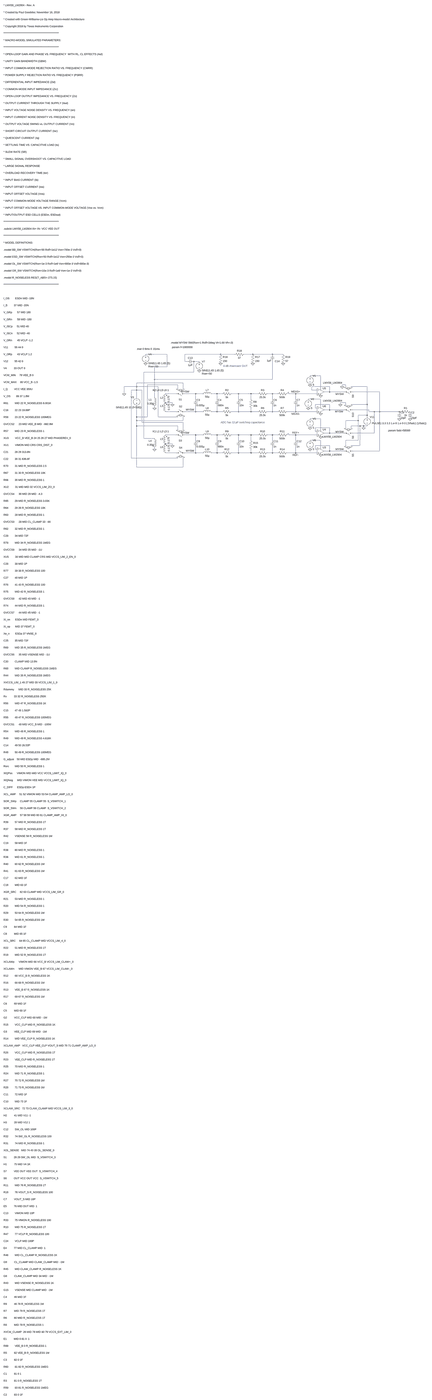
[diagram p0: schematic DiffVNAFull.asc, whole sheet]
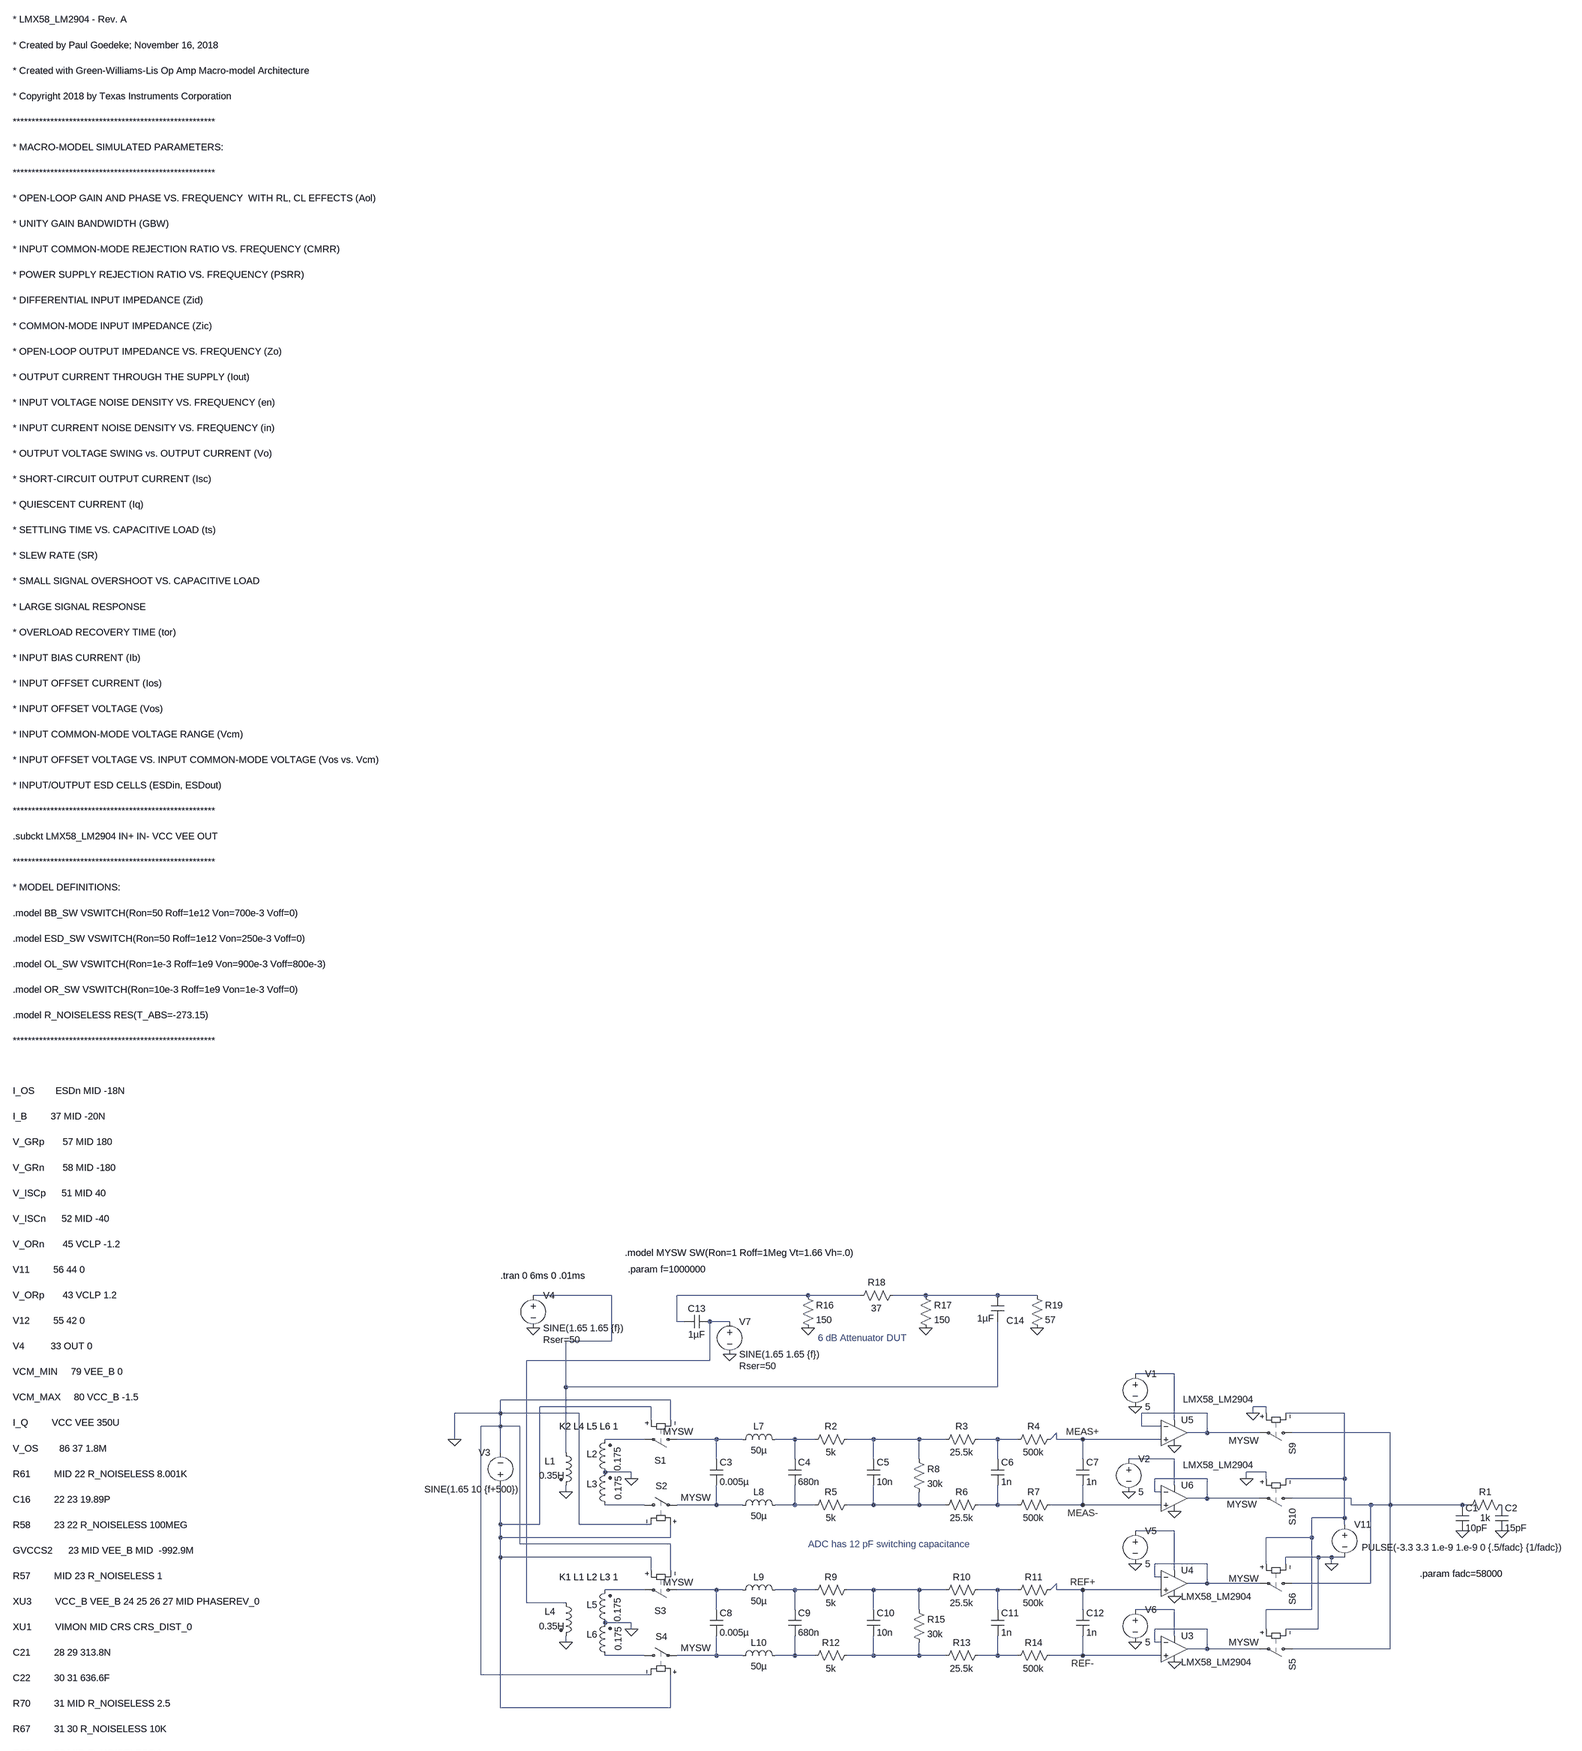
[diagram p1: schematic DiffVNAFull.asc, part, row 1 of 3, column 1 of 1]
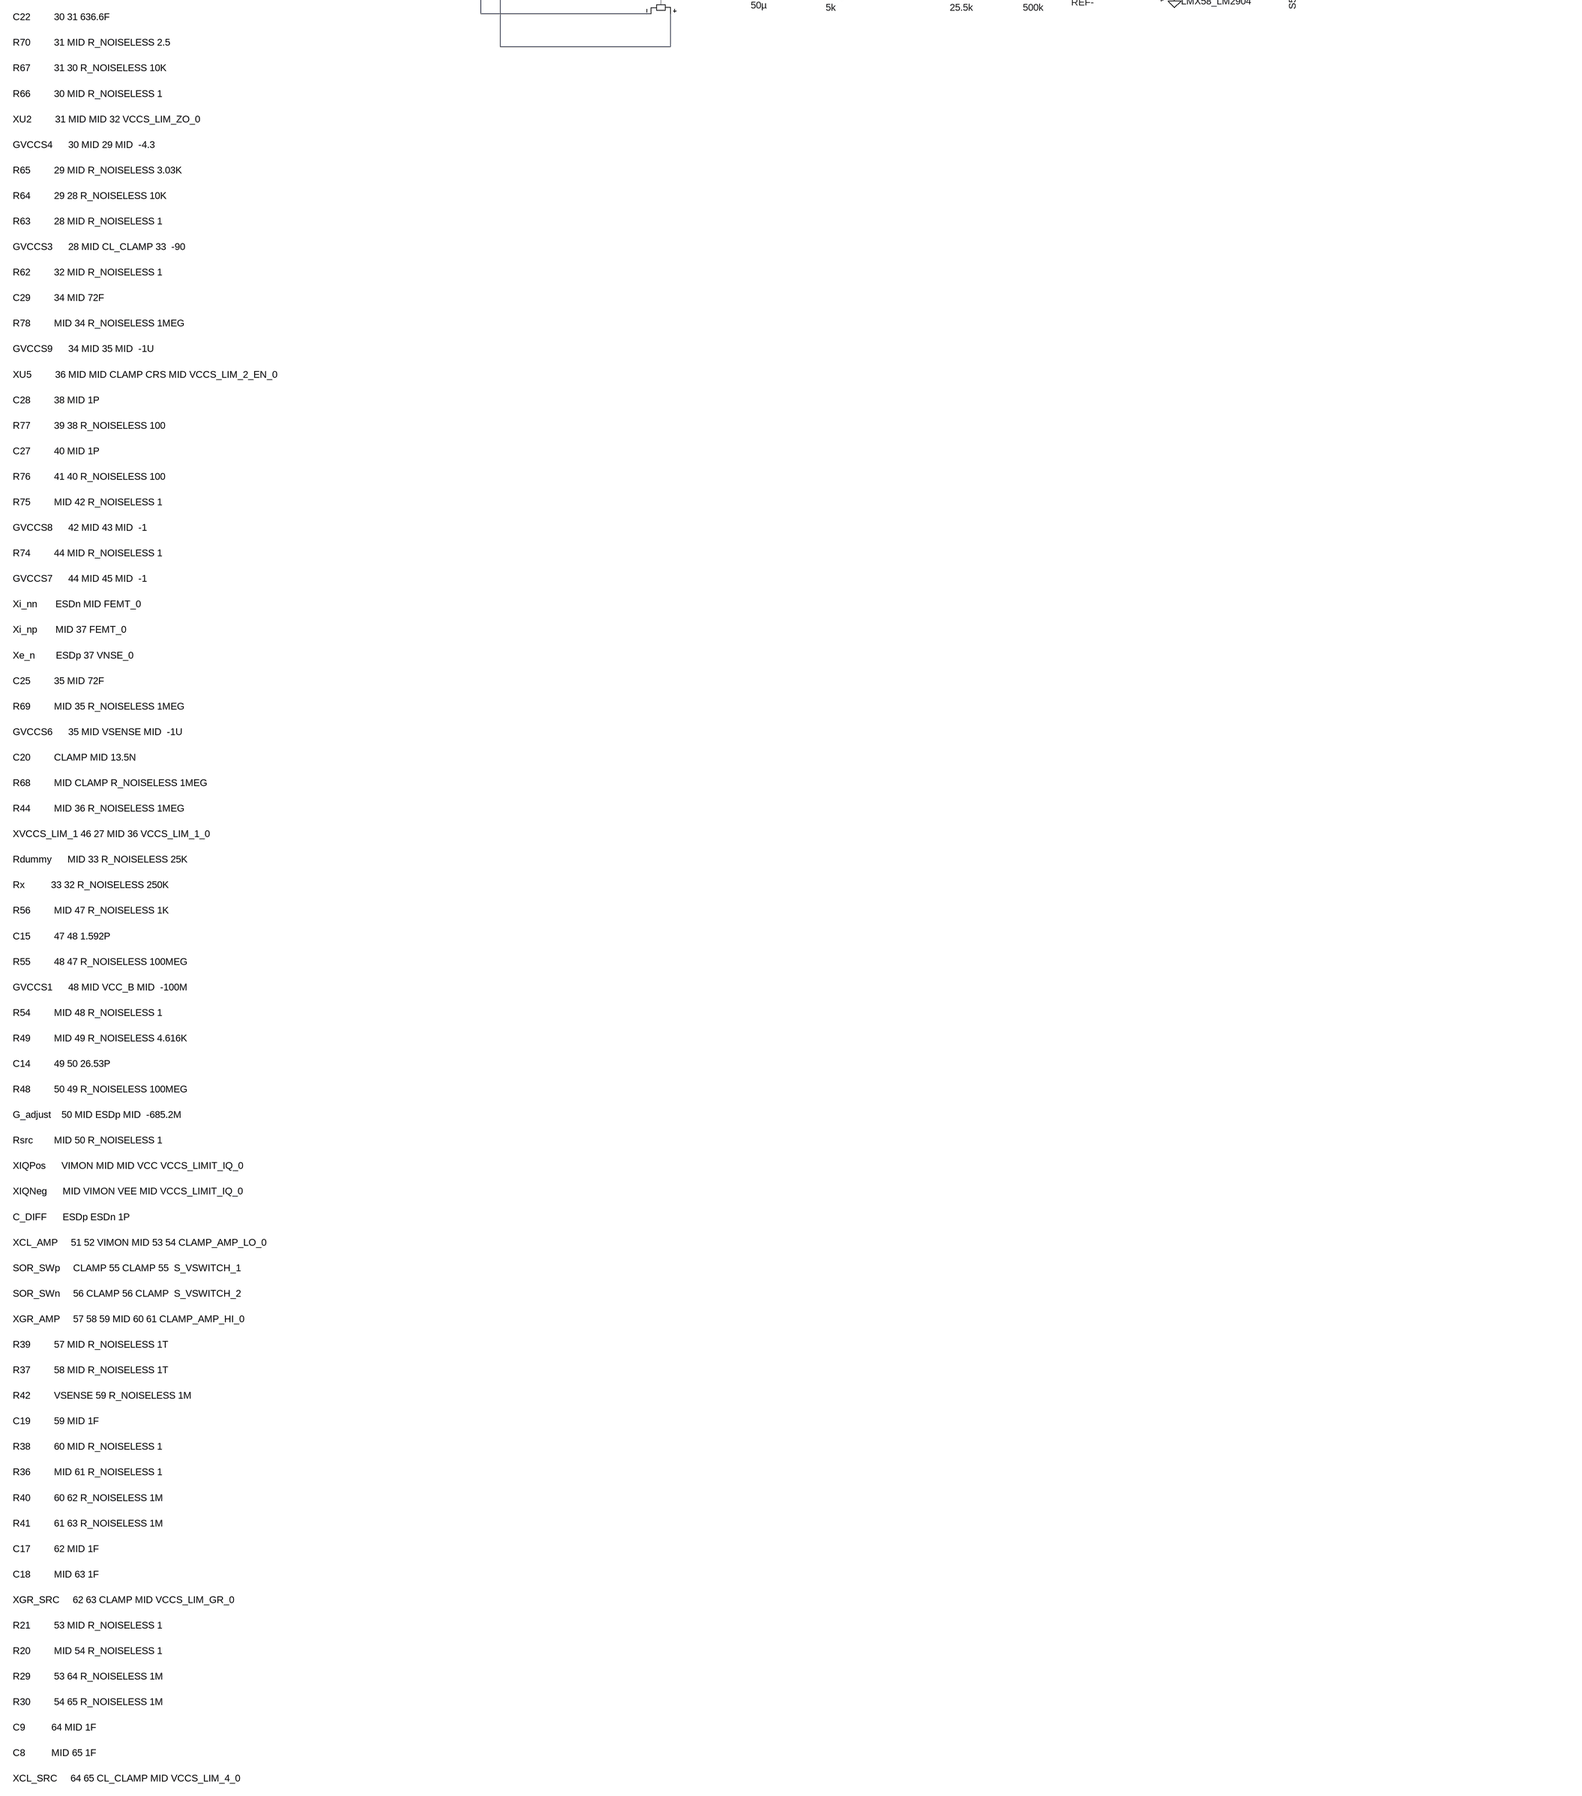
[diagram p2: schematic DiffVNAFull.asc, part, row 2 of 3, column 1 of 1]
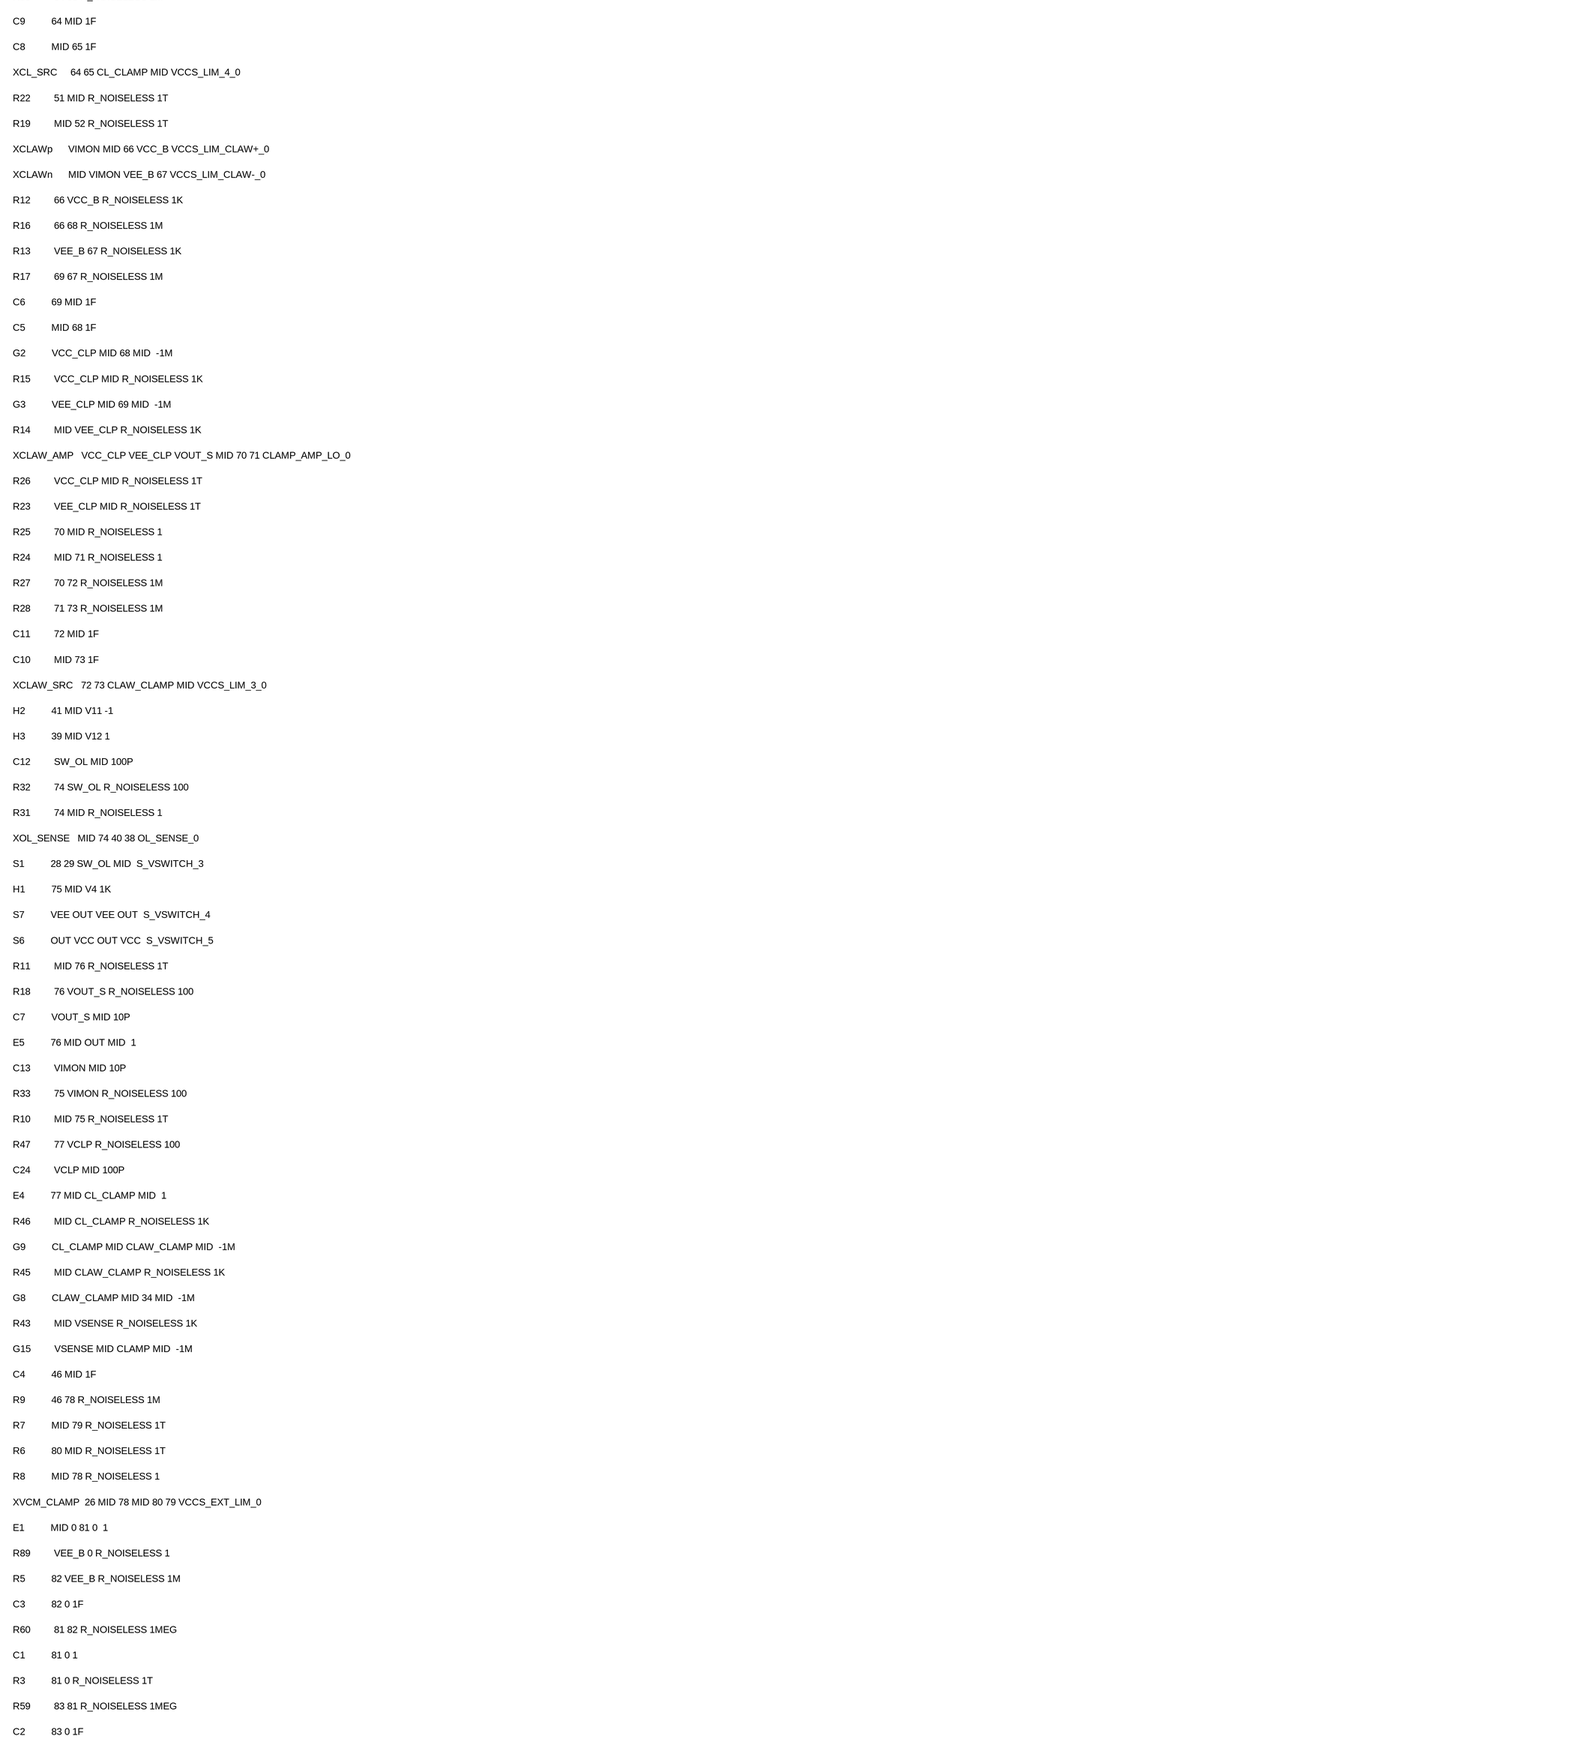
[diagram p3: schematic DiffVNAFull.asc, part, row 3 of 3, column 1 of 1]
DiffVNAFull.asc, the LTspice schematic file:
Version 4
SHEET 1 2648 7540
WIRE -80 64 -272 64
WIRE 400 64 80 64
WIRE 528 64 400 64
WIRE 688 64 608 64
WIRE 864 64 688 64
WIRE 960 64 864 64
WIRE 80 128 80 64
WIRE 96 128 80 128
WIRE 208 128 160 128
WIRE -80 176 -80 64
WIRE -80 176 -192 176
WIRE 160 224 160 128
WIRE 160 224 -288 224
WIRE 1296 256 1200 256
WIRE -192 288 -192 176
WIRE 864 288 864 128
WIRE 864 288 -192 288
WIRE 64 320 -352 320
WIRE 16 336 -256 336
WIRE 1520 336 1488 336
WIRE -352 352 -352 320
WIRE -352 352 -464 352
WIRE -160 352 -352 352
WIRE 1376 352 1216 352
WIRE 1488 352 1488 336
WIRE 1520 352 1520 336
WIRE 1712 352 1568 352
WIRE 16 368 16 336
WIRE 64 368 64 320
WIRE 1296 368 1296 256
WIRE -352 384 -352 352
WIRE -352 384 -400 384
WIRE -304 384 -352 384
WIRE 1216 384 1216 352
WIRE 1264 384 1216 384
WIRE 1376 400 1376 352
WIRE 1376 400 1328 400
WIRE 1504 400 1376 400
WIRE 1824 400 1584 400
WIRE -464 416 -464 352
WIRE 0 416 -96 416
WIRE 176 416 80 416
WIRE 240 416 176 416
WIRE 368 416 320 416
WIRE 416 416 368 416
WIRE 560 416 496 416
WIRE 672 416 560 416
WIRE 736 416 672 416
WIRE 864 416 816 416
WIRE 912 416 864 416
WIRE 992 416 1008 400
WIRE 1008 416 1008 400
WIRE 1072 416 1008 416
WIRE 1264 416 1072 416
WIRE -352 448 -352 384
WIRE -192 448 -192 288
WIRE 176 464 176 416
WIRE 368 464 368 416
WIRE 560 464 560 416
WIRE 672 464 672 416
WIRE 864 464 864 416
WIRE 1072 464 1072 416
WIRE 1296 464 1184 464
WIRE -32 496 -96 496
WIRE 1520 496 1472 496
WIRE -32 512 -32 496
WIRE 1376 512 1248 512
WIRE 1472 512 1472 496
WIRE 1520 512 1520 496
WIRE 1712 512 1712 352
WIRE 1712 512 1568 512
WIRE 1296 528 1296 464
WIRE -192 544 -192 528
WIRE 1248 544 1248 512
WIRE 1264 544 1248 544
WIRE 1376 560 1376 512
WIRE 1376 560 1328 560
WIRE 1504 560 1376 560
WIRE 1728 560 1584 560
WIRE 0 576 -96 576
WIRE 176 576 176 528
WIRE 176 576 80 576
WIRE 240 576 176 576
WIRE 368 576 368 528
WIRE 368 576 320 576
WIRE 416 576 368 576
WIRE 560 576 560 528
WIRE 560 576 496 576
WIRE 672 576 672 544
WIRE 672 576 560 576
WIRE 736 576 672 576
WIRE 864 576 864 528
WIRE 864 576 816 576
WIRE 912 576 864 576
WIRE 1072 576 1072 528
WIRE 1072 576 992 576
WIRE 1264 576 1072 576
WIRE 1728 576 1728 560
WIRE 1776 576 1728 576
WIRE 1824 576 1824 400
WIRE 1824 576 1776 576
WIRE 2000 576 1824 576
WIRE 2016 576 2000 576
WIRE 1712 608 1712 512
WIRE 1712 608 1632 608
WIRE -352 624 -352 528
WIRE -256 624 -256 336
WIRE -256 624 -352 624
WIRE -160 624 -160 352
WIRE 16 624 -160 624
WIRE 1712 624 1712 608
WIRE 1296 640 1200 640
WIRE -352 656 -352 624
WIRE 64 656 64 624
WIRE 64 656 -352 656
WIRE 1632 656 1632 608
WIRE 1632 656 1520 656
WIRE -304 672 -304 384
WIRE 64 672 -304 672
WIRE -352 704 -352 656
WIRE 16 704 -352 704
WIRE 1648 704 1568 704
WIRE 1680 704 1648 704
WIRE 1712 704 1680 704
WIRE 1376 720 1248 720
WIRE 1520 720 1520 656
WIRE 1568 720 1568 704
WIRE 1680 720 1680 704
WIRE 16 736 16 704
WIRE 64 736 64 672
WIRE 1296 736 1296 640
WIRE 1248 752 1248 720
WIRE 1264 752 1248 752
WIRE 1376 768 1376 720
WIRE 1376 768 1328 768
WIRE 1504 768 1376 768
WIRE 1776 768 1776 576
WIRE 1776 768 1584 768
WIRE 0 784 -96 784
WIRE 176 784 80 784
WIRE 240 784 176 784
WIRE 368 784 320 784
WIRE 416 784 368 784
WIRE 560 784 496 784
WIRE 672 784 560 784
WIRE 736 784 672 784
WIRE 864 784 816 784
WIRE 912 784 864 784
WIRE 992 784 1008 768
WIRE 1008 784 1008 768
WIRE 1072 784 1008 784
WIRE 1264 784 1072 784
WIRE -288 816 -288 224
WIRE -192 816 -288 816
WIRE 176 832 176 784
WIRE 368 832 368 784
WIRE 560 832 560 784
WIRE 672 832 672 784
WIRE 864 832 864 784
WIRE 1072 832 1072 784
WIRE 1296 832 1200 832
WIRE 1632 832 1632 656
WIRE 1632 832 1520 832
WIRE -32 864 -96 864
WIRE -32 880 -32 864
WIRE 1376 880 1248 880
WIRE 1520 880 1520 832
WIRE 1648 880 1648 704
WIRE 1648 880 1568 880
WIRE 1296 896 1296 832
WIRE -192 912 -192 896
WIRE 1248 912 1248 880
WIRE 1264 912 1248 912
WIRE 1376 928 1376 880
WIRE 1376 928 1328 928
WIRE 1504 928 1376 928
WIRE 1824 928 1824 576
WIRE 1824 928 1584 928
WIRE 0 944 -96 944
WIRE 176 944 176 896
WIRE 176 944 80 944
WIRE 240 944 176 944
WIRE 368 944 368 896
WIRE 368 944 320 944
WIRE 416 944 368 944
WIRE 560 944 560 896
WIRE 560 944 496 944
WIRE 672 944 672 912
WIRE 672 944 560 944
WIRE 736 944 672 944
WIRE 864 944 864 896
WIRE 864 944 816 944
WIRE 912 944 864 944
WIRE 1072 944 1072 896
WIRE 1072 944 992 944
WIRE 1264 944 1072 944
WIRE -400 992 -400 384
WIRE 16 992 -400 992
WIRE -352 1072 -352 704
WIRE 64 1072 64 992
WIRE 64 1072 -352 1072
FLAG 1296 800 0
FLAG 1296 960 0
FLAG 1184 544 0
FLAG 1200 336 0
FLAG 1200 912 0
FLAG 1200 720 0
FLAG 1296 592 0
FLAG 1296 432 0
FLAG 2000 640 0
FLAG 2096 640 0
FLAG 1488 352 0
FLAG 1472 512 0
FLAG 1680 720 0
FLAG -272 144 0
FLAG 1072 416 MEAS+
FLAG 1072 576 MEAS-
FLAG -192 544 0
FLAG 1072 784 REF+
FLAG 1072 944 REF-
FLAG -192 912 0
FLAG -464 416 0
FLAG -32 512 0
FLAG -32 880 0
FLAG 208 208 0
FLAG 688 144 0
FLAG 400 144 0
FLAG 960 144 0
SYMBOL Opamps\\opamp2 1296 864 R0
SYMATTR InstName U3
SYMATTR Value LMX58_LM2904
SYMBOL Opamps\\opamp2 1296 704 R0
SYMATTR InstName U4
SYMATTR Value LMX58_LM2904
SYMBOL Opamps\\opamp2 1296 336 R0
WINDOW 3 21 -18 Left 2
SYMATTR Value LMX58_LM2904
SYMATTR InstName U5
SYMBOL Opamps\\opamp2 1296 496 R0
WINDOW 3 21 -18 Left 2
SYMATTR Value LMX58_LM2904
SYMATTR InstName U6
SYMBOL voltage 1184 448 R0
WINDOW 123 0 0 Left 2
WINDOW 39 0 0 Left 2
SYMATTR InstName V2
SYMATTR Value 5
SYMBOL voltage 1200 624 R0
WINDOW 123 0 0 Left 2
WINDOW 39 0 0 Left 2
SYMATTR InstName V5
SYMATTR Value 5
SYMBOL voltage 1200 816 R0
WINDOW 123 0 0 Left 2
WINDOW 39 0 0 Left 2
SYMATTR InstName V6
SYMATTR Value 5
SYMBOL voltage 1200 240 R0
WINDOW 123 0 0 Left 2
WINDOW 39 0 0 Left 2
SYMATTR InstName V1
SYMATTR Value 5
SYMBOL sw 1600 928 R90
WINDOW 3 -16 97 VRight 2
SYMATTR Value MYSW
SYMATTR InstName S5
SYMBOL sw 1600 768 R90
WINDOW 3 -12 97 VRight 2
SYMATTR Value MYSW
SYMATTR InstName S6
SYMBOL sw 1600 400 R90
WINDOW 3 19 97 VRight 2
SYMATTR Value MYSW
SYMATTR InstName S9
SYMBOL sw 1600 560 R90
WINDOW 3 15 102 VRight 2
SYMATTR Value MYSW
SYMATTR InstName S10
SYMBOL voltage 1712 608 R0
WINDOW 123 0 0 Left 2
WINDOW 39 0 0 Left 2
WINDOW 3 42 72 Left 2
SYMATTR Value PULSE(-3.3 3.3 1.e-9 1.e-9 0 {.5/fadc} {1/fadc})
SYMATTR InstName V11
SYMBOL cap 1984 576 R0
SYMATTR InstName C1
SYMATTR Value 10pF
SYMBOL cap 2080 576 R0
SYMATTR InstName C2
SYMATTR Value 15pF
SYMBOL res 2112 560 R90
WINDOW 0 0 56 VBottom 2
WINDOW 3 32 56 VTop 2
SYMATTR InstName R1
SYMATTR Value 1k
SYMBOL res 512 400 R90
WINDOW 0 0 56 VBottom 2
WINDOW 3 32 56 VTop 2
SYMATTR InstName R2
SYMATTR Value 5k
SYMBOL res 832 400 R90
WINDOW 0 0 56 VBottom 2
WINDOW 3 32 56 VTop 2
SYMATTR InstName R3
SYMATTR Value 25.5k
SYMBOL res 1008 400 R90
WINDOW 0 0 56 VBottom 2
WINDOW 3 32 56 VTop 2
SYMATTR InstName R4
SYMATTR Value 500k
SYMBOL res 512 560 R90
WINDOW 0 0 56 VBottom 2
WINDOW 3 32 56 VTop 2
SYMATTR InstName R5
SYMATTR Value 5k
SYMBOL res 832 560 R90
WINDOW 0 0 56 VBottom 2
WINDOW 3 32 56 VTop 2
SYMATTR InstName R6
SYMATTR Value 25.5k
SYMBOL res 1008 560 R90
WINDOW 0 0 56 VBottom 2
WINDOW 3 32 56 VTop 2
SYMATTR InstName R7
SYMATTR Value 500k
SYMBOL sw 96 416 R90
WINDOW 0 51 42 VRight 2
WINDOW 3 -19 -24 VRight 2
SYMATTR InstName S1
SYMATTR Value MYSW
SYMBOL sw -16 576 R270
WINDOW 0 46 43 VRight 2
WINDOW 3 18 105 VRight 2
SYMATTR InstName S2
SYMATTR Value MYSW
SYMBOL ind2 -208 432 R0
WINDOW 0 -36 37 Left 2
WINDOW 3 -50 72 Left 2
SYMATTR InstName L1
SYMATTR Value 0.35H
SYMATTR SpiceLine Ipk=0.43 Rser=2.58 Rpar=94200 Cpar=0
SYMATTR Type ind
SYMBOL ind2 -80 512 R180
WINDOW 0 34 60 Left 2
WINDOW 3 -14 79 VLeft 2
SYMATTR InstName L2
SYMATTR Value 0.175
SYMATTR Type ind
SYMBOL ind2 -80 592 R180
WINDOW 0 34 67 Left 2
WINDOW 3 -16 28 VRight 2
SYMATTR InstName L3
SYMATTR Value 0.175
SYMATTR Type ind
SYMBOL ind2 -208 800 R0
WINDOW 0 -36 37 Left 2
WINDOW 3 -50 72 Left 2
SYMATTR InstName L4
SYMATTR Value 0.35H
SYMATTR SpiceLine Ipk=0.43 Rser=2.58 Rpar=94200 Cpar=0
SYMATTR Type ind
SYMBOL ind2 -80 880 R180
WINDOW 0 34 60 Left 2
WINDOW 3 -14 79 VLeft 2
SYMATTR InstName L5
SYMATTR Value 0.175
SYMATTR Type ind
SYMBOL ind2 -80 960 R180
WINDOW 0 34 67 Left 2
WINDOW 3 -16 28 VRight 2
SYMATTR InstName L6
SYMATTR Value 0.175
SYMATTR Type ind
SYMBOL sw 96 784 R90
WINDOW 0 51 42 VRight 2
WINDOW 3 -19 -24 VRight 2
SYMATTR InstName S3
SYMATTR Value MYSW
SYMBOL sw -16 944 R270
WINDOW 0 46 43 VRight 2
WINDOW 3 18 105 VRight 2
SYMATTR InstName S4
SYMATTR Value MYSW
SYMBOL ind 224 432 R270
WINDOW 0 32 56 VTop 2
WINDOW 3 5 56 VBottom 2
SYMATTR InstName L7
SYMATTR Value 50µ
SYMBOL ind 224 592 R270
WINDOW 0 32 56 VTop 2
WINDOW 3 5 56 VBottom 2
SYMATTR InstName L8
SYMATTR Value 50µ
SYMBOL cap 160 464 R0
SYMATTR InstName C3
SYMATTR Value 0.005µ
SYMBOL cap 352 464 R0
SYMATTR InstName C4
SYMATTR Value 680n
SYMBOL cap 544 464 R0
SYMATTR InstName C5
SYMATTR Value 10n
SYMBOL cap 848 464 R0
SYMATTR InstName C6
SYMATTR Value 1n
SYMBOL cap 1056 464 R0
SYMATTR InstName C7
SYMATTR Value 1n
SYMBOL cap 160 832 R0
SYMATTR InstName C8
SYMATTR Value 0.005µ
SYMBOL res 656 448 R0
SYMATTR InstName R8
SYMATTR Value 30k
SYMBOL voltage -352 544 R180
WINDOW 0 24 96 Left 2
WINDOW 3 -52 6 Left 2
WINDOW 123 0 0 Left 2
WINDOW 39 0 0 Left 2
SYMATTR InstName V3
SYMATTR Value SINE(1.65 10 {f+500})
SYMBOL res 512 768 R90
WINDOW 0 0 56 VBottom 2
WINDOW 3 32 56 VTop 2
SYMATTR InstName R9
SYMATTR Value 5k
SYMBOL res 832 768 R90
WINDOW 0 0 56 VBottom 2
WINDOW 3 32 56 VTop 2
SYMATTR InstName R10
SYMATTR Value 25.5k
SYMBOL res 1008 768 R90
WINDOW 0 0 56 VBottom 2
WINDOW 3 32 56 VTop 2
SYMATTR InstName R11
SYMATTR Value 500k
SYMBOL res 512 928 R90
WINDOW 0 0 56 VBottom 2
WINDOW 3 32 56 VTop 2
SYMATTR InstName R12
SYMATTR Value 5k
SYMBOL res 832 928 R90
WINDOW 0 0 56 VBottom 2
WINDOW 3 32 56 VTop 2
SYMATTR InstName R13
SYMATTR Value 25.5k
SYMBOL res 1008 928 R90
WINDOW 0 0 56 VBottom 2
WINDOW 3 32 56 VTop 2
SYMATTR InstName R14
SYMATTR Value 500k
SYMBOL ind 224 800 R270
WINDOW 0 32 56 VTop 2
WINDOW 3 5 56 VBottom 2
SYMATTR InstName L9
SYMATTR Value 50µ
SYMBOL ind 224 960 R270
WINDOW 0 32 56 VTop 2
WINDOW 3 5 56 VBottom 2
SYMATTR InstName L10
SYMATTR Value 50µ
SYMBOL cap 352 832 R0
SYMATTR InstName C9
SYMATTR Value 680n
SYMBOL cap 544 832 R0
SYMATTR InstName C10
SYMATTR Value 10n
SYMBOL cap 848 832 R0
SYMATTR InstName C11
SYMATTR Value 1n
SYMBOL cap 1056 832 R0
SYMATTR InstName C12
SYMATTR Value 1n
SYMBOL res 656 816 R0
SYMATTR InstName R15
SYMATTR Value 30k
SYMBOL voltage -272 48 R0
WINDOW 123 0 0 Left 2
WINDOW 39 24 124 Left 2
SYMATTR SpiceLine Rser=50
SYMATTR InstName V4
SYMATTR Value SINE(1.65 1.65 {f})
SYMBOL voltage 208 112 R0
WINDOW 123 0 0 Left 2
WINDOW 39 24 124 Left 2
SYMATTR SpiceLine Rser=50
SYMATTR InstName V7
SYMATTR Value SINE(1.65 1.65 {f})
SYMBOL cap 160 112 R90
WINDOW 0 0 32 VBottom 2
WINDOW 3 32 32 VTop 2
SYMATTR InstName C13
SYMATTR Value 1µF
SYMBOL res 384 48 R0
SYMATTR InstName R16
SYMATTR Value 150
SYMBOL res 672 48 R0
SYMATTR InstName R17
SYMATTR Value 150
SYMBOL res 624 48 R90
WINDOW 0 0 56 VBottom 2
WINDOW 3 32 56 VTop 2
SYMATTR InstName R18
SYMATTR Value 37
SYMBOL cap 880 128 R180
WINDOW 0 -49 2 Left 2
WINDOW 3 24 8 Left 2
SYMATTR InstName C14
SYMATTR Value 1µF
SYMBOL res 944 48 R0
SYMATTR InstName R19
SYMATTR Value 57
TEXT 1896 744 Left 2 !.param fadc=58000
TEXT -1960 -3088 Left 2 !* LMX58_LM2904 - Rev. A\n\n* Created by Paul Goedeke; November 16, 2018\n\n* Created with Green-Williams-Lis Op Amp Macro-model Architecture\n\n* Copyright 2018 by Texas Instruments Corporation\n\n******************************************************\n\n* MACRO-MODEL SIMULATED PARAMETERS:\n\n******************************************************\n\n* OPEN-LOOP GAIN AND PHASE VS. FREQUENCY  WITH RL, CL EFFECTS (Aol)\n\n* UNITY GAIN BANDWIDTH (GBW)\n\n* INPUT COMMON-MODE REJECTION RATIO VS. FREQUENCY (CMRR)\n\n* POWER SUPPLY REJECTION RATIO VS. FREQUENCY (PSRR)\n\n* DIFFERENTIAL INPUT IMPEDANCE (Zid)\n\n* COMMON-MODE INPUT IMPEDANCE (Zic)\n\n* OPEN-LOOP OUTPUT IMPEDANCE VS. FREQUENCY (Zo)\n\n* OUTPUT CURRENT THROUGH THE SUPPLY (Iout)\n\n* INPUT VOLTAGE NOISE DENSITY VS. FREQUENCY (en)\n\n* INPUT CURRENT NOISE DENSITY VS. FREQUENCY (in)\n\n* OUTPUT VOLTAGE SWING vs. OUTPUT CURRENT (Vo)\n\n* SHORT-CIRCUIT OUTPUT CURRENT (Isc)\n\n* QUIESCENT CURRENT (Iq)\n\n* SETTLING TIME VS. CAPACITIVE LOAD (ts)\n\n* SLEW RATE (SR)\n\n* SMALL SIGNAL OVERSHOOT VS. CAPACITIVE LOAD\n\n* LARGE SIGNAL RESPONSE\n\n* OVERLOAD RECOVERY TIME (tor)\n\n* INPUT BIAS CURRENT (Ib)\n\n* INPUT OFFSET CURRENT (Ios)\n\n* INPUT OFFSET VOLTAGE (Vos)\n\n* INPUT COMMON-MODE VOLTAGE RANGE (Vcm)\n\n* INPUT OFFSET VOLTAGE VS. INPUT COMMON-MODE VOLTAGE (Vos vs. Vcm)\n\n* INPUT/OUTPUT ESD CELLS (ESDin, ESDout)\n\n******************************************************\n\n.subckt LMX58_LM2904 IN+ IN- VCC VEE OUT\n\n******************************************************\n\n* MODEL DEFINITIONS:\n\n.model BB_SW VSWITCH(Ron=50 Roff=1e12 Von=700e-3 Voff=0)\n\n.model ESD_SW VSWITCH(Ron=50 Roff=1e12 Von=250e-3 Voff=0)\n\n.model OL_SW VSWITCH(Ron=1e-3 Roff=1e9 Von=900e-3 Voff=800e-3)\n\n.model OR_SW VSWITCH(Ron=10e-3 Roff=1e9 Von=1e-3 Voff=0)\n\n.model R_NOISELESS RES(T_ABS=-273.15)\n\n******************************************************\n\n\n\n\nI_OS        ESDn MID -18N\n\nI_B         37 MID -20N\n\nV_GRp       57 MID 180\n\nV_GRn       58 MID -180\n\nV_ISCp      51 MID 40\n\nV_ISCn      52 MID -40\n\nV_ORn       45 VCLP -1.2\n\nV11         56 44 0\n\nV_ORp       43 VCLP 1.2\n\nV12         55 42 0\n\nV4          33 OUT 0\n\nVCM_MIN     79 VEE_B 0\n\nVCM_MAX     80 VCC_B -1.5\n\nI_Q         VCC VEE 350U\n\nV_OS        86 37 1.8M\n\nR61         MID 22 R_NOISELESS 8.001K \n\nC16         22 23 19.89P \n\nR58         23 22 R_NOISELESS 100MEG \n\nGVCCS2      23 MID VEE_B MID  -992.9M\n\nR57         MID 23 R_NOISELESS 1 \n\nXU3         VCC_B VEE_B 24 25 26 27 MID PHASEREV_0\n\nXU1         VIMON MID CRS CRS_DIST_0\n\nC21         28 29 313.8N  \n\nC22         30 31 636.6F  \n\nR70         31 MID R_NOISELESS 2.5 \n\nR67         31 30 R_NOISELESS 10K \n\nR66         30 MID R_NOISELESS 1 \n\nXU2         31 MID MID 32 VCCS_LIM_ZO_0\n\nGVCCS4      30 MID 29 MID  -4.3\n\nR65         29 MID R_NOISELESS 3.03K \n\nR64         29 28 R_NOISELESS 10K \n\nR63         28 MID R_NOISELESS 1 \n\nGVCCS3      28 MID CL_CLAMP 33  -90\n\nR62         32 MID R_NOISELESS 1 \n\nC29         34 MID 72F \n\nR78         MID 34 R_NOISELESS 1MEG \n\nGVCCS9      34 MID 35 MID  -1U\n\nXU5         36 MID MID CLAMP CRS MID VCCS_LIM_2_EN_0\n\nC28         38 MID 1P \n\nR77         39 38 R_NOISELESS 100 \n\nC27         40 MID 1P \n\nR76         41 40 R_NOISELESS 100 \n\nR75         MID 42 R_NOISELESS 1 \n\nGVCCS8      42 MID 43 MID  -1\n\nR74         44 MID R_NOISELESS 1 \n\nGVCCS7      44 MID 45 MID  -1\n\nXi_nn       ESDn MID FEMT_0\n\nXi_np       MID 37 FEMT_0\n\nXe_n        ESDp 37 VNSE_0\n\nC25         35 MID 72F \n\nR69         MID 35 R_NOISELESS 1MEG \n\nGVCCS6      35 MID VSENSE MID  -1U\n\nC20         CLAMP MID 13.5N \n\nR68         MID CLAMP R_NOISELESS 1MEG \n\nR44         MID 36 R_NOISELESS 1MEG \n\nXVCCS_LIM_1 46 27 MID 36 VCCS_LIM_1_0\n\nRdummy      MID 33 R_NOISELESS 25K \n\nRx          33 32 R_NOISELESS 250K \n\nR56         MID 47 R_NOISELESS 1K \n\nC15         47 48 1.592P \n\nR55         48 47 R_NOISELESS 100MEG \n\nGVCCS1      48 MID VCC_B MID  -100M\n\nR54         MID 48 R_NOISELESS 1 \n\nR49         MID 49 R_NOISELESS 4.616K \n\nC14         49 50 26.53P \n\nR48         50 49 R_NOISELESS 100MEG \n\nG_adjust    50 MID ESDp MID  -685.2M\n\nRsrc        MID 50 R_NOISELESS 1 \n\nXIQPos      VIMON MID MID VCC VCCS_LIMIT_IQ_0\n\nXIQNeg      MID VIMON VEE MID VCCS_LIMIT_IQ_0\n\nC_DIFF      ESDp ESDn 1P \n\nXCL_AMP     51 52 VIMON MID 53 54 CLAMP_AMP_LO_0\n\nSOR_SWp     CLAMP 55 CLAMP 55  S_VSWITCH_1\n\nSOR_SWn     56 CLAMP 56 CLAMP  S_VSWITCH_2\n\nXGR_AMP     57 58 59 MID 60 61 CLAMP_AMP_HI_0\n\nR39         57 MID R_NOISELESS 1T \n\nR37         58 MID R_NOISELESS 1T \n\nR42         VSENSE 59 R_NOISELESS 1M \n\nC19         59 MID 1F \n\nR38         60 MID R_NOISELESS 1 \n\nR36         MID 61 R_NOISELESS 1 \n\nR40         60 62 R_NOISELESS 1M \n\nR41         61 63 R_NOISELESS 1M \n\nC17         62 MID 1F \n\nC18         MID 63 1F \n\nXGR_SRC     62 63 CLAMP MID VCCS_LIM_GR_0\n\nR21         53 MID R_NOISELESS 1 \n\nR20         MID 54 R_NOISELESS 1 \n\nR29         53 64 R_NOISELESS 1M \n\nR30         54 65 R_NOISELESS 1M \n\nC9          64 MID 1F \n\nC8          MID 65 1F \n\nXCL_SRC     64 65 CL_CLAMP MID VCCS_LIM_4_0\n\nR22         51 MID R_NOISELESS 1T \n\nR19         MID 52 R_NOISELESS 1T \n\nXCLAWp      VIMON MID 66 VCC_B VCCS_LIM_CLAW+_0\n\nXCLAWn      MID VIMON VEE_B 67 VCCS_LIM_CLAW-_0\n\nR12         66 VCC_B R_NOISELESS 1K \n\nR16         66 68 R_NOISELESS 1M \n\nR13         VEE_B 67 R_NOISELESS 1K \n\nR17         69 67 R_NOISELESS 1M \n\nC6          69 MID 1F \n\nC5          MID 68 1F \n\nG2          VCC_CLP MID 68 MID  -1M\n\nR15         VCC_CLP MID R_NOISELESS 1K \n\nG3          VEE_CLP MID 69 MID  -1M\n\nR14         MID VEE_CLP R_NOISELESS 1K \n\nXCLAW_AMP   VCC_CLP VEE_CLP VOUT_S MID 70 71 CLAMP_AMP_LO_0\n\nR26         VCC_CLP MID R_NOISELESS 1T \n\nR23         VEE_CLP MID R_NOISELESS 1T \n\nR25         70 MID R_NOISELESS 1 \n\nR24         MID 71 R_NOISELESS 1 \n\nR27         70 72 R_NOISELESS 1M \n\nR28         71 73 R_NOISELESS 1M \n\nC11         72 MID 1F \n\nC10         MID 73 1F \n\nXCLAW_SRC   72 73 CLAW_CLAMP MID VCCS_LIM_3_0\n\nH2          41 MID V11 -1\n\nH3          39 MID V12 1\n\nC12         SW_OL MID 100P \n\nR32         74 SW_OL R_NOISELESS 100 \n\nR31         74 MID R_NOISELESS 1 \n\nXOL_SENSE   MID 74 40 38 OL_SENSE_0\n\nS1          28 29 SW_OL MID  S_VSWITCH_3\n\nH1          75 MID V4 1K\n\nS7          VEE OUT VEE OUT  S_VSWITCH_4\n\nS6          OUT VCC OUT VCC  S_VSWITCH_5\n\nR11         MID 76 R_NOISELESS 1T \n\nR18         76 VOUT_S R_NOISELESS 100 \n\nC7          VOUT_S MID 10P \n\nE5          76 MID OUT MID  1\n\nC13         VIMON MID 10P \n\nR33         75 VIMON R_NOISELESS 100 \n\nR10         MID 75 R_NOISELESS 1T \n\nR47         77 VCLP R_NOISELESS 100 \n\nC24         VCLP MID 100P \n\nE4          77 MID CL_CLAMP MID  1\n\nR46         MID CL_CLAMP R_NOISELESS 1K \n\nG9          CL_CLAMP MID CLAW_CLAMP MID  -1M\n\nR45         MID CLAW_CLAMP R_NOISELESS 1K \n\nG8          CLAW_CLAMP MID 34 MID  -1M\n\nR43         MID VSENSE R_NOISELESS 1K \n\nG15         VSENSE MID CLAMP MID  -1M\n\nC4          46 MID 1F \n\nR9          46 78 R_NOISELESS 1M \n\nR7          MID 79 R_NOISELESS 1T \n\nR6          80 MID R_NOISELESS 1T \n\nR8          MID 78 R_NOISELESS 1 \n\nXVCM_CLAMP  26 MID 78 MID 80 79 VCCS_EXT_LIM_0\n\nE1          MID 0 81 0  1\n\nR89         VEE_B 0 R_NOISELESS 1 \n\nR5          82 VEE_B R_NOISELESS 1M \n\nC3          82 0 1F \n\nR60         81 82 R_NOISELESS 1MEG \n\nC1          81 0 1 \n\nR3          81 0 R_NOISELESS 1T \n\nR59         83 81 R_NOISELESS 1MEG \n\nC2          83 0 1F \n\nR4          VCC_B 83 R_NOISELESS 1M \n\nR88         VCC_B 0 R_NOISELESS 1 \n\nG17         VEE_B 0 VEE 0  -1\n\nG16         VCC_B 0 VCC 0  -1\n\nR_PSR       84 24 R_NOISELESS 1K \n\nG_PSR       24 84 47 22  -1M\n\nR2          25 ESDn R_NOISELESS 1M \n\nR1          84 85 R_NOISELESS 1M \n\nR_CMR       86 85 R_NOISELESS 1K \n\nG_CMR       85 86 49 MID  -1M\n\nC_CMn       ESDn MID 2P \n\nC_CMp       MID ESDp 2P \n\nR53         ESDn MID R_NOISELESS 1T \n\nR52         MID ESDp R_NOISELESS 1T \n\nR35         IN- ESDn R_NOISELESS 10M \n\nR34         IN+ ESDp R_NOISELESS 10M \n\n\n.MODEL S_VSWITCH_1 VSWITCH (RON=10M ROFF=1T VON=10M VOFF=0)\n\n.MODEL S_VSWITCH_2 VSWITCH (RON=10M ROFF=1T VON=10M VOFF=0)\n\n.MODEL S_VSWITCH_3 VSWITCH (RON=1M ROFF=1T VON=500M VOFF=100M)\n\n.MODEL S_VSWITCH_4 VSWITCH (RON=50 ROFF=1T VON=500M VOFF=450M)\n\n.MODEL S_VSWITCH_5 VSWITCH (RON=50 ROFF=1T VON=500M VOFF=450M)\n\n\n.ENDS LMX58_LM2904\n\n*\n\n.SUBCKT PHASEREV_0  VCC VEE VIN+ VIN- VOUT+ VOUT- MID\n\nE1 VOUT+ MID VALUE={IF(V(VIN+,MID)<V(VEE,MID)-0.3,V(VCC,MID),V(VIN+,MID))}\n\nE2 VOUT- MID VALUE={IF(V(VIN-,MID)<V(VEE,MID)-0.3,V(VCC,MID),V(VIN-,MID))}\n\n.ENDS\n\n*\n\n\n\n\n.SUBCKT CRS_DIST_0  VIMON MID OUT\n\nV1 VREF MID -40M\n\nESHF VSHF MID VIMON VREF 1\n\nGZC MID ZC VALUE = {SGN(V(VSHF,MID))}\n\nR1 ZC MID 1\n\nC1 ZC MID 2U\n\nGCR MID OUT VALUE = {IF((ABS(V(ZC,MID))<=0.9),0,1)}\n\nR2 OUT MID 1\n\n.ENDS\n\n*\n\n\n\n\n.SUBCKT VCCS_LIM_ZO_0  VC+ VC- IOUT+ IOUT-\n\n.PARAM GAIN = 4E3\n\n.PARAM IPOS = 1E6\n\n.PARAM INEG = -1E6\n\nG1 IOUT+ IOUT- VALUE={LIMIT(GAIN*V(VC+,VC-),INEG,IPOS)}\n\n.ENDS\n\n*\n\n\n\n\n.SUBCKT VCCS_LIM_2_EN_0  VC+ VC- IOUT+ IOUT- EN MID\n\n.PARAM GAIN = 8.4E-4\n\n.PARAM IPOS = 0.005\n\n.PARAM INEG = -0.005\n\nG1 IOUT+ IOUT- VALUE={LIMIT(GAIN*V(EN,MID)*V(VC+,VC-),INEG,IPOS)}\n\n.ENDS\n\n*\n\n\n\n\n.SUBCKT FEMT_0  1 2\n\n.PARAM FLWF=1E-3\n\n.PARAM NLFF=500\n\n.PARAM NVRF=500\n\n.PARAM GLFF={PWR(FLWF,0.25)*NLFF/1164}\n\n.PARAM RNVF={1.184*PWR(NVRF,2)}\n\n.MODEL DVNF D KF={PWR(FLWF,0.5)/1E11} IS=1.0E-16\n\nI1 0 7 10E-3\n\nI2 0 8 10E-3\n\nD1 7 0 DVNF\n\nD2 8 0 DVNF\n\nE1 3 6 7 8 {GLFF}\n\nR1 3 0 1E9\n\nR2 3 0 1E9\n\nR3 3 6 1E9\n\nE2 6 4 5 0 10\n\nR4 5 0 {RNVF}\n\nR5 5 0 {RNVF}\n\nR6 3 4 1E9\n\nR7 4 0 1E9\n\nG1 1 2 3 4 1E-6\n\n.ENDS\n\n*\n\n\n\n\n.SUBCKT VNSE_0  1 2\n\n.PARAM FLW=10\n\n.PARAM NLF=80\n\n.PARAM NVR=35\n\n.PARAM GLF={PWR(FLW,0.25)*NLF/1164}\n\n.PARAM RNV={1.184*PWR(NVR,2)}\n\n.MODEL DVN D KF={PWR(FLW,0.5)/1E11} IS=1.0E-16\n\nI1 0 7 10E-3\n\nI2 0 8 10E-3\n\nD1 7 0 DVN\n\nD2 8 0 DVN\n\nE1 3 6 7 8 {GLF}\n\nR1 3 0 1E9\n\nR2 3 0 1E9\n\nR3 3 6 1E9\n\nE2 6 4 5 0 10\n\nR4 5 0 {RNV}\n\nR5 5 0 {RNV}\n\nR6 3 4 1E9\n\nR7 4 0 1E9\n\nE3 1 2 3 4 1\n\n.ENDS\n\n*\n\n\n\n\n.SUBCKT VCCS_LIM_1_0  VC+ VC- IOUT+ IOUT-\n\n.PARAM GAIN = 1E-4\n\n.PARAM IPOS = .5\n\n.PARAM INEG = -.5\n\nG1 IOUT+ IOUT- VALUE={LIMIT(GAIN*V(VC+,VC-),INEG,IPOS)}\n\n.ENDS\n\n*\n\n\n\n\n.SUBCKT VCCS_LIMIT_IQ_0  VC+ VC- IOUT+ IOUT-\n\n.PARAM GAIN = 1E-3\n\nG1 IOUT- IOUT+ VALUE={IF( (V(VC+,VC-)<=0),0,GAIN*V(VC+,VC-) )}\n\n.ENDS\n\n*\n\n\n\n\n.SUBCKT CLAMP_AMP_LO_0  VC+ VC- VIN COM VO+ VO-\n\n.PARAM G=1\n\nGVO+ COM VO+ VALUE = {IF(V(VIN,COM)>V(VC+,COM),((V(VIN,COM)-V(VC+,COM))*G),0)}\n\nGVO- COM VO- VALUE = {IF(V(VIN,COM)<V(VC-,COM),((V(VC-,COM)-V(VIN,COM))*G),0)}\n\n.ENDS\n\n*\n\n\n\n\n.SUBCKT CLAMP_AMP_HI_0  VC+ VC- VIN COM VO+ VO-\n\n.PARAM G=10\n\nGVO+ COM VO+ VALUE = {IF(V(VIN,COM)>V(VC+,COM),((V(VIN,COM)-V(VC+,COM))*G),0)}\n\nGVO- COM VO- VALUE = {IF(V(VIN,COM)<V(VC-,COM),((V(VC-,COM)-V(VIN,COM))*G),0)}\n\n.ENDS\n\n*\n\n\n\n\n.SUBCKT VCCS_LIM_GR_0  VC+ VC- IOUT+ IOUT-\n\n.PARAM GAIN = 1\n\n.PARAM IPOS = 0.013\n\n.PARAM INEG = -0.013\n\nG1 IOUT+ IOUT- VALUE={LIMIT(GAIN*V(VC+,VC-),INEG,IPOS)}\n\n.ENDS\n\n*\n\n\n\n\n.SUBCKT VCCS_LIM_4_0  VC+ VC- IOUT+ IOUT-\n\n.PARAM GAIN = 1\n\n.PARAM IPOS = 1.04\n\n.PARAM INEG = -1.04\n\nG1 IOUT+ IOUT- VALUE={LIMIT(GAIN*V(VC+,VC-),INEG,IPOS)}\n\n.ENDS\n\n*\n\n\n\n\n.SUBCKT VCCS_LIM_CLAW+_0  VC+ VC- IOUT+ IOUT-\n\nG1 IOUT+ IOUT- TABLE {ABS(V(VC+,VC-))} =\n\n+(0, 1.17E-03)\n\n+(0.0046251, 1.17E-3)\n\n+(0.15716, 1.21E-3)\n\n+(1.3309, 1.28E-3)\n\n+(35.075, 2.12E-3)\n\n+(35.680, 2.55E-3)\n\n+(36.033, 2.84E-3)\n\n+(37.416, 7.97E-3)\n\n.ENDS\n\n*\n\n\n\n\n.SUBCKT VCCS_LIM_CLAW-_0  VC+ VC- IOUT+ IOUT-\n\nG1 IOUT+ IOUT- TABLE {ABS(V(VC+,VC-))} =\n\n+(0.010, 2.50E-5)\n\n+(0.070, 2.50E-5)\n\n+(0.090, 5.80E-4)\n\n+(0.100, 6.06E-4)\n\n+(0.760, 7.14E-4) \n\n+(1.440, 7.62E-4)\n\n+(8.000, 1.10E-3)\n\n+(13.60, 1.55E-3)\n\n+(15.45, 1.75E-3)\n\n+(17.26, 2.15E-3)\n\n+(18.87, 2.94E-3)\n\n+(21.58, 4.50E-3)\n\n+(25.53, 1.02E-2)\n\n.ENDS\n\n*\n\n\n\n\n\n.SUBCKT VCCS_LIM_3_0  VC+ VC- IOUT+ IOUT-\n\n.PARAM GAIN = 1\n\n.PARAM IPOS = 0.435\n\n.PARAM INEG = -0.435\n\nG1 IOUT+ IOUT- VALUE={LIMIT(GAIN*V(VC+,VC-),INEG,IPOS)}\n\n.ENDS\n\n*\n\n\n\n\n.SUBCKT OL_SENSE_0  COM SW+ OLN  OLP\n\nGSW+ COM SW+ VALUE = {IF((V(OLN,COM)>10E-3 | V(OLP,COM)>10E-3),1,0)}\n\n.ENDS\n\n*\n\n\n\n\n.SUBCKT VCCS_EXT_LIM_0  VIN+ VIN- IOUT- IOUT+ VP+ VP-\n\n.PARAM GAIN = 1\n\nG1 IOUT+ IOUT- VALUE={LIMIT(GAIN*V(VIN+,VIN-),V(VP-,VIN-), V(VP+,VIN-))}\n\n.ENDS\n\n*
TEXT -352 16 Left 2 !.tran 0 6ms 0 .01ms
TEXT 400 672 Left 2 ;ADC has 12 pF switching capacitance
TEXT -208 752 Left 2 !K1 L1 L2 L3 1
TEXT -208 384 Left 2 !K2 L4 L5 L6 1
TEXT -48 -40 Left 2 !.model MYSW SW(Ron=1 Roff=1Meg Vt=1.66 Vh=.0)
TEXT -40 0 Left 2 !.param f=1000000
TEXT 424 168 Left 2 ;6 dB Attenuator DUT

The netlist it stands for:
* DiffVNAFull.asc
XU3 REF- N030 N029 0 N030 LMX58_LM2904  ; pins In+ In- V+ V- OUT
XU4 REF+ N023 N022 0 N023 LMX58_LM2904  ; pins In+ In- V+ V- OUT
XU5 MEAS+ N007 N005 0 N007 LMX58_LM2904  ; pins In+ In- V+ V- OUT
XU6 MEAS- N016 N015 0 N016 LMX58_LM2904  ; pins In+ In- V+ V- OUT
V2 N015 0 5
V5 N022 0 5
V6 N029 0 5
V1 N005 0 5
S5 N009 N030 N008 0 MYSW
S6 N009 N023 N008 0 MYSW
S9 N009 N007 0 N008 MYSW
S10 N009 N016 0 N008 MYSW
V11 N008 0 PULSE(-3.3 3.3 1.e-9 1.e-9 0 {.5/fadc} {1/fadc})
C1 N009 0 10pF
C2 P001 0 15pF
R1 P001 N009 1k
R2 N013 N012 5k
R3 N014 N013 25.5k
R4 MEAS+ N014 500k
R5 N020 N019 5k
R6 N021 N020 25.5k
R7 MEAS- N021 500k
S1 N011 N010 N006 0 MYSW
S2 N017 N018 N006 0 MYSW
L1 N001 0 0.35H Ipk=0.43 Rser=2.58 Rpar=94200 Cpar=0
L2 0 N010 0.175
L3 N017 0 0.175
L4 N004 0 0.35H Ipk=0.43 Rser=2.58 Rpar=94200 Cpar=0
L5 0 N024 0.175
L6 N031 0 0.175
S3 N025 N024 N006 0 MYSW
S4 N031 N032 N006 0 MYSW
L7 N011 N012 50µ
L8 N018 N019 50µ
C3 N011 N018 0.005µ
C4 N012 N019 680n
C5 N013 N020 10n
C6 N014 N021 1n
C7 MEAS+ MEAS- 1n
C8 N025 N032 0.005µ
R8 N013 N020 30k
V3 N006 0 SINE(1.65 10 {f+500})
R9 N027 N026 5k
R10 N028 N027 25.5k
R11 REF+ N028 500k
R12 N034 N033 5k
R13 N035 N034 25.5k
R14 REF- N035 500k
L9 N025 N026 50µ
L10 N032 N033 50µ
C9 N026 N033 680n
C10 N027 N034 10n
C11 N028 N035 1n
C12 REF+ REF- 1n
R15 N027 N034 30k
V4 N001 0 SINE(1.65 1.65 {f}) Rser=50
V7 N004 0 SINE(1.65 1.65 {f}) Rser=50
C13 N004 N002 1µF
R16 N002 0 150
R17 N003 0 150
R18 N003 N002 37
C14 N001 N003 1µF
R19 N003 0 57
.param fadc=58000
* LMX58_LM2904 - Rev. A
* Created by Paul Goedeke; November 16, 2018
* Created with Green-Williams-Lis Op Amp Macro-model Architecture
* Copyright 2018 by Texas Instruments Corporation
******************************************************
* MACRO-MODEL SIMULATED PARAMETERS:
******************************************************
* OPEN-LOOP GAIN AND PHASE VS. FREQUENCY  WITH RL, CL EFFECTS (Aol)
* UNITY GAIN BANDWIDTH (GBW)
* INPUT COMMON-MODE REJECTION RATIO VS. FREQUENCY (CMRR)
* POWER SUPPLY REJECTION RATIO VS. FREQUENCY (PSRR)
* DIFFERENTIAL INPUT IMPEDANCE (Zid)
* COMMON-MODE INPUT IMPEDANCE (Zic)
* OPEN-LOOP OUTPUT IMPEDANCE VS. FREQUENCY (Zo)
* OUTPUT CURRENT THROUGH THE SUPPLY (Iout)
* INPUT VOLTAGE NOISE DENSITY VS. FREQUENCY (en)
* INPUT CURRENT NOISE DENSITY VS. FREQUENCY (in)
* OUTPUT VOLTAGE SWING vs. OUTPUT CURRENT (Vo)
* SHORT-CIRCUIT OUTPUT CURRENT (Isc)
* QUIESCENT CURRENT (Iq)
* SETTLING TIME VS. CAPACITIVE LOAD (ts)
* SLEW RATE (SR)
* SMALL SIGNAL OVERSHOOT VS. CAPACITIVE LOAD
* LARGE SIGNAL RESPONSE
* OVERLOAD RECOVERY TIME (tor)
* INPUT BIAS CURRENT (Ib)
* INPUT OFFSET CURRENT (Ios)
* INPUT OFFSET VOLTAGE (Vos)
* INPUT COMMON-MODE VOLTAGE RANGE (Vcm)
* INPUT OFFSET VOLTAGE VS. INPUT COMMON-MODE VOLTAGE (Vos vs. Vcm)
* INPUT/OUTPUT ESD CELLS (ESDin, ESDout)
******************************************************
.subckt LMX58_LM2904 IN+ IN- VCC VEE OUT
******************************************************
* MODEL DEFINITIONS:
.model BB_SW VSWITCH(Ron=50 Roff=1e12 Von=700e-3 Voff=0)
.model ESD_SW VSWITCH(Ron=50 Roff=1e12 Von=250e-3 Voff=0)
.model OL_SW VSWITCH(Ron=1e-3 Roff=1e9 Von=900e-3 Voff=800e-3)
.model OR_SW VSWITCH(Ron=10e-3 Roff=1e9 Von=1e-3 Voff=0)
.model R_NOISELESS RES(T_ABS=-273.15)
******************************************************
I_OS        ESDn MID -18N
I_B         37 MID -20N
V_GRp       57 MID 180
V_GRn       58 MID -180
V_ISCp      51 MID 40
V_ISCn      52 MID -40
V_ORn       45 VCLP -1.2
V11         56 44 0
V_ORp       43 VCLP 1.2
V12         55 42 0
V4          33 OUT 0
VCM_MIN     79 VEE_B 0
VCM_MAX     80 VCC_B -1.5
I_Q         VCC VEE 350U
V_OS        86 37 1.8M
R61         MID 22 R_NOISELESS 8.001K
C16         22 23 19.89P
R58         23 22 R_NOISELESS 100MEG
GVCCS2      23 MID VEE_B MID  -992.9M
R57         MID 23 R_NOISELESS 1
XU3         VCC_B VEE_B 24 25 26 27 MID PHASEREV_0
XU1         VIMON MID CRS CRS_DIST_0
C21         28 29 313.8N
C22         30 31 636.6F
R70         31 MID R_NOISELESS 2.5
R67         31 30 R_NOISELESS 10K
R66         30 MID R_NOISELESS 1
XU2         31 MID MID 32 VCCS_LIM_ZO_0
GVCCS4      30 MID 29 MID  -4.3
R65         29 MID R_NOISELESS 3.03K
R64         29 28 R_NOISELESS 10K
R63         28 MID R_NOISELESS 1
GVCCS3      28 MID CL_CLAMP 33  -90
R62         32 MID R_NOISELESS 1
C29         34 MID 72F
R78         MID 34 R_NOISELESS 1MEG
GVCCS9      34 MID 35 MID  -1U
XU5         36 MID MID CLAMP CRS MID VCCS_LIM_2_EN_0
C28         38 MID 1P
R77         39 38 R_NOISELESS 100
C27         40 MID 1P
R76         41 40 R_NOISELESS 100
R75         MID 42 R_NOISELESS 1
GVCCS8      42 MID 43 MID  -1
R74         44 MID R_NOISELESS 1
GVCCS7      44 MID 45 MID  -1
Xi_nn       ESDn MID FEMT_0
Xi_np       MID 37 FEMT_0
Xe_n        ESDp 37 VNSE_0
C25         35 MID 72F
R69         MID 35 R_NOISELESS 1MEG
GVCCS6      35 MID VSENSE MID  -1U
C20         CLAMP MID 13.5N
R68         MID CLAMP R_NOISELESS 1MEG
R44         MID 36 R_NOISELESS 1MEG
XVCCS_LIM_1 46 27 MID 36 VCCS_LIM_1_0
Rdummy      MID 33 R_NOISELESS 25K
Rx          33 32 R_NOISELESS 250K
R56         MID 47 R_NOISELESS 1K
C15         47 48 1.592P
R55         48 47 R_NOISELESS 100MEG
GVCCS1      48 MID VCC_B MID  -100M
R54         MID 48 R_NOISELESS 1
R49         MID 49 R_NOISELESS 4.616K
C14         49 50 26.53P
R48         50 49 R_NOISELESS 100MEG
G_adjust    50 MID ESDp MID  -685.2M
Rsrc        MID 50 R_NOISELESS 1
XIQPos      VIMON MID MID VCC VCCS_LIMIT_IQ_0
XIQNeg      MID VIMON VEE MID VCCS_LIMIT_IQ_0
C_DIFF      ESDp ESDn 1P
XCL_AMP     51 52 VIMON MID 53 54 CLAMP_AMP_LO_0
SOR_SWp     CLAMP 55 CLAMP 55  S_VSWITCH_1
SOR_SWn     56 CLAMP 56 CLAMP  S_VSWITCH_2
XGR_AMP     57 58 59 MID 60 61 CLAMP_AMP_HI_0
R39         57 MID R_NOISELESS 1T
R37         58 MID R_NOISELESS 1T
R42         VSENSE 59 R_NOISELESS 1M
C19         59 MID 1F
R38         60 MID R_NOISELESS 1
R36         MID 61 R_NOISELESS 1
R40         60 62 R_NOISELESS 1M
R41         61 63 R_NOISELESS 1M
C17         62 MID 1F
C18         MID 63 1F
XGR_SRC     62 63 CLAMP MID VCCS_LIM_GR_0
R21         53 MID R_NOISELESS 1
R20         MID 54 R_NOISELESS 1
R29         53 64 R_NOISELESS 1M
R30         54 65 R_NOISELESS 1M
C9          64 MID 1F
C8          MID 65 1F
XCL_SRC     64 65 CL_CLAMP MID VCCS_LIM_4_0
R22         51 MID R_NOISELESS 1T
R19         MID 52 R_NOISELESS 1T
XCLAWp      VIMON MID 66 VCC_B VCCS_LIM_CLAW+_0
XCLAWn      MID VIMON VEE_B 67 VCCS_LIM_CLAW-_0
R12         66 VCC_B R_NOISELESS 1K
R16         66 68 R_NOISELESS 1M
R13         VEE_B 67 R_NOISELESS 1K
R17         69 67 R_NOISELESS 1M
C6          69 MID 1F
C5          MID 68 1F
G2          VCC_CLP MID 68 MID  -1M
R15         VCC_CLP MID R_NOISELESS 1K
G3          VEE_CLP MID 69 MID  -1M
R14         MID VEE_CLP R_NOISELESS 1K
XCLAW_AMP   VCC_CLP VEE_CLP VOUT_S MID 70 71 CLAMP_AMP_LO_0
R26         VCC_CLP MID R_NOISELESS 1T
R23         VEE_CLP MID R_NOISELESS 1T
R25         70 MID R_NOISELESS 1
R24         MID 71 R_NOISELESS 1
R27         70 72 R_NOISELESS 1M
R28         71 73 R_NOISELESS 1M
C11         72 MID 1F
C10         MID 73 1F
XCLAW_SRC   72 73 CLAW_CLAMP MID VCCS_LIM_3_0
H2          41 MID V11 -1
H3          39 MID V12 1
C12         SW_OL MID 100P
R32         74 SW_OL R_NOISELESS 100
R31         74 MID R_NOISELESS 1
XOL_SENSE   MID 74 40 38 OL_SENSE_0
S1          28 29 SW_OL MID  S_VSWITCH_3
H1          75 MID V4 1K
S7          VEE OUT VEE OUT  S_VSWITCH_4
S6          OUT VCC OUT VCC  S_VSWITCH_5
R11         MID 76 R_NOISELESS 1T
R18         76 VOUT_S R_NOISELESS 100
C7          VOUT_S MID 10P
E5          76 MID OUT MID  1
C13         VIMON MID 10P
R33         75 VIMON R_NOISELESS 100
R10         MID 75 R_NOISELESS 1T
R47         77 VCLP R_NOISELESS 100
C24         VCLP MID 100P
E4          77 MID CL_CLAMP MID  1
R46         MID CL_CLAMP R_NOISELESS 1K
G9          CL_CLAMP MID CLAW_CLAMP MID  -1M
R45         MID CLAW_CLAMP R_NOISELESS 1K
G8          CLAW_CLAMP MID 34 MID  -1M
R43         MID VSENSE R_NOISELESS 1K
G15         VSENSE MID CLAMP MID  -1M
C4          46 MID 1F
R9          46 78 R_NOISELESS 1M
R7          MID 79 R_NOISELESS 1T
R6          80 MID R_NOISELESS 1T
R8          MID 78 R_NOISELESS 1
XVCM_CLAMP  26 MID 78 MID 80 79 VCCS_EXT_LIM_0
E1          MID 0 81 0  1
R89         VEE_B 0 R_NOISELESS 1
R5          82 VEE_B R_NOISELESS 1M
C3          82 0 1F
R60         81 82 R_NOISELESS 1MEG
C1          81 0 1
R3          81 0 R_NOISELESS 1T
R59         83 81 R_NOISELESS 1MEG
C2          83 0 1F
R4          VCC_B 83 R_NOISELESS 1M
R88         VCC_B 0 R_NOISELESS 1
G17         VEE_B 0 VEE 0  -1
G16         VCC_B 0 VCC 0  -1
R_PSR       84 24 R_NOISELESS 1K
G_PSR       24 84 47 22  -1M
R2          25 ESDn R_NOISELESS 1M
R1          84 85 R_NOISELESS 1M
R_CMR       86 85 R_NOISELESS 1K
G_CMR       85 86 49 MID  -1M
C_CMn       ESDn MID 2P
C_CMp       MID ESDp 2P
R53         ESDn MID R_NOISELESS 1T
R52         MID ESDp R_NOISELESS 1T
R35         IN- ESDn R_NOISELESS 10M
R34         IN+ ESDp R_NOISELESS 10M
.MODEL S_VSWITCH_1 VSWITCH (RON=10M ROFF=1T VON=10M VOFF=0)
.MODEL S_VSWITCH_2 VSWITCH (RON=10M ROFF=1T VON=10M VOFF=0)
.MODEL S_VSWITCH_3 VSWITCH (RON=1M ROFF=1T VON=500M VOFF=100M)
.MODEL S_VSWITCH_4 VSWITCH (RON=50 ROFF=1T VON=500M VOFF=450M)
.MODEL S_VSWITCH_5 VSWITCH (RON=50 ROFF=1T VON=500M VOFF=450M)
.ENDS LMX58_LM2904
*
.SUBCKT PHASEREV_0  VCC VEE VIN+ VIN- VOUT+ VOUT- MID
E1 VOUT+ MID VALUE={IF(V(VIN+,MID)<V(VEE,MID)-0.3,V(VCC,MID),V(VIN+,MID))}
E2 VOUT- MID VALUE={IF(V(VIN-,MID)<V(VEE,MID)-0.3,V(VCC,MID),V(VIN-,MID))}
.ENDS
*
.SUBCKT CRS_DIST_0  VIMON MID OUT
V1 VREF MID -40M
ESHF VSHF MID VIMON VREF 1
GZC MID ZC VALUE = {SGN(V(VSHF,MID))}
R1 ZC MID 1
C1 ZC MID 2U
GCR MID OUT VALUE = {IF((ABS(V(ZC,MID))<=0.9),0,1)}
R2 OUT MID 1
.ENDS
*
.SUBCKT VCCS_LIM_ZO_0  VC+ VC- IOUT+ IOUT-
.PARAM GAIN = 4E3
.PARAM IPOS = 1E6
.PARAM INEG = -1E6
G1 IOUT+ IOUT- VALUE={LIMIT(GAIN*V(VC+,VC-),INEG,IPOS)}
.ENDS
*
.SUBCKT VCCS_LIM_2_EN_0  VC+ VC- IOUT+ IOUT- EN MID
.PARAM GAIN = 8.4E-4
.PARAM IPOS = 0.005
.PARAM INEG = -0.005
G1 IOUT+ IOUT- VALUE={LIMIT(GAIN*V(EN,MID)*V(VC+,VC-),INEG,IPOS)}
.ENDS
*
.SUBCKT FEMT_0  1 2
.PARAM FLWF=1E-3
.PARAM NLFF=500
.PARAM NVRF=500
.PARAM GLFF={PWR(FLWF,0.25)*NLFF/1164}
.PARAM RNVF={1.184*PWR(NVRF,2)}
.MODEL DVNF D KF={PWR(FLWF,0.5)/1E11} IS=1.0E-16
I1 0 7 10E-3
I2 0 8 10E-3
D1 7 0 DVNF
D2 8 0 DVNF
E1 3 6 7 8 {GLFF}
R1 3 0 1E9
R2 3 0 1E9
R3 3 6 1E9
E2 6 4 5 0 10
R4 5 0 {RNVF}
R5 5 0 {RNVF}
R6 3 4 1E9
R7 4 0 1E9
G1 1 2 3 4 1E-6
.ENDS
*
.SUBCKT VNSE_0  1 2
.PARAM FLW=10
.PARAM NLF=80
.PARAM NVR=35
.PARAM GLF={PWR(FLW,0.25)*NLF/1164}
.PARAM RNV={1.184*PWR(NVR,2)}
.MODEL DVN D KF={PWR(FLW,0.5)/1E11} IS=1.0E-16
I1 0 7 10E-3
I2 0 8 10E-3
D1 7 0 DVN
D2 8 0 DVN
E1 3 6 7 8 {GLF}
R1 3 0 1E9
R2 3 0 1E9
R3 3 6 1E9
E2 6 4 5 0 10
R4 5 0 {RNV}
R5 5 0 {RNV}
R6 3 4 1E9
R7 4 0 1E9
E3 1 2 3 4 1
.ENDS
*
.SUBCKT VCCS_LIM_1_0  VC+ VC- IOUT+ IOUT-
.PARAM GAIN = 1E-4
.PARAM IPOS = .5
.PARAM INEG = -.5
G1 IOUT+ IOUT- VALUE={LIMIT(GAIN*V(VC+,VC-),INEG,IPOS)}
.ENDS
*
.SUBCKT VCCS_LIMIT_IQ_0  VC+ VC- IOUT+ IOUT-
.PARAM GAIN = 1E-3
G1 IOUT- IOUT+ VALUE={IF( (V(VC+,VC-)<=0),0,GAIN*V(VC+,VC-) )}
.ENDS
*
.SUBCKT CLAMP_AMP_LO_0  VC+ VC- VIN COM VO+ VO-
.PARAM G=1
GVO+ COM VO+ VALUE = {IF(V(VIN,COM)>V(VC+,COM),((V(VIN,COM)-V(VC+,COM))*G),0)}
GVO- COM VO- VALUE = {IF(V(VIN,COM)<V(VC-,COM),((V(VC-,COM)-V(VIN,COM))*G),0)}
.ENDS
*
.SUBCKT CLAMP_AMP_HI_0  VC+ VC- VIN COM VO+ VO-
.PARAM G=10
GVO+ COM VO+ VALUE = {IF(V(VIN,COM)>V(VC+,COM),((V(VIN,COM)-V(VC+,COM))*G),0)}
GVO- COM VO- VALUE = {IF(V(VIN,COM)<V(VC-,COM),((V(VC-,COM)-V(VIN,COM))*G),0)}
.ENDS
*
.SUBCKT VCCS_LIM_GR_0  VC+ VC- IOUT+ IOUT-
.PARAM GAIN = 1
.PARAM IPOS = 0.013
.PARAM INEG = -0.013
G1 IOUT+ IOUT- VALUE={LIMIT(GAIN*V(VC+,VC-),INEG,IPOS)}
.ENDS
*
.SUBCKT VCCS_LIM_4_0  VC+ VC- IOUT+ IOUT-
.PARAM GAIN = 1
.PARAM IPOS = 1.04
.PARAM INEG = -1.04
G1 IOUT+ IOUT- VALUE={LIMIT(GAIN*V(VC+,VC-),INEG,IPOS)}
.ENDS
*
.SUBCKT VCCS_LIM_CLAW+_0  VC+ VC- IOUT+ IOUT-
G1 IOUT+ IOUT- TABLE {ABS(V(VC+,VC-))} =
+(0, 1.17E-03)
+(0.0046251, 1.17E-3)
+(0.15716, 1.21E-3)
+(1.3309, 1.28E-3)
+(35.075, 2.12E-3)
+(35.680, 2.55E-3)
+(36.033, 2.84E-3)
+(37.416, 7.97E-3)
.ENDS
*
.SUBCKT VCCS_LIM_CLAW-_0  VC+ VC- IOUT+ IOUT-
G1 IOUT+ IOUT- TABLE {ABS(V(VC+,VC-))} =
+(0.010, 2.50E-5)
+(0.070, 2.50E-5)
+(0.090, 5.80E-4)
+(0.100, 6.06E-4)
+(0.760, 7.14E-4)
+(1.440, 7.62E-4)
+(8.000, 1.10E-3)
+(13.60, 1.55E-3)
+(15.45, 1.75E-3)
+(17.26, 2.15E-3)
+(18.87, 2.94E-3)
+(21.58, 4.50E-3)
+(25.53, 1.02E-2)
.ENDS
*
.SUBCKT VCCS_LIM_3_0  VC+ VC- IOUT+ IOUT-
.PARAM GAIN = 1
.PARAM IPOS = 0.435
.PARAM INEG = -0.435
G1 IOUT+ IOUT- VALUE={LIMIT(GAIN*V(VC+,VC-),INEG,IPOS)}
.ENDS
*
.SUBCKT OL_SENSE_0  COM SW+ OLN  OLP
GSW+ COM SW+ VALUE = {IF((V(OLN,COM)>10E-3 | V(OLP,COM)>10E-3),1,0)}
.ENDS
*
.SUBCKT VCCS_EXT_LIM_0  VIN+ VIN- IOUT- IOUT+ VP+ VP-
.PARAM GAIN = 1
G1 IOUT+ IOUT- VALUE={LIMIT(GAIN*V(VIN+,VIN-),V(VP-,VIN-), V(VP+,VIN-))}
.ENDS
*
.tran 0 6ms 0 .01ms
* ADC has 12 pF switching capacitance
K1 L1 L2 L3 1
K2 L4 L5 L6 1
.model MYSW SW(Ron=1 Roff=1Meg Vt=1.66 Vh=.0)
.param f=1000000
* 6 dB Attenuator DUT
.backanno
.end